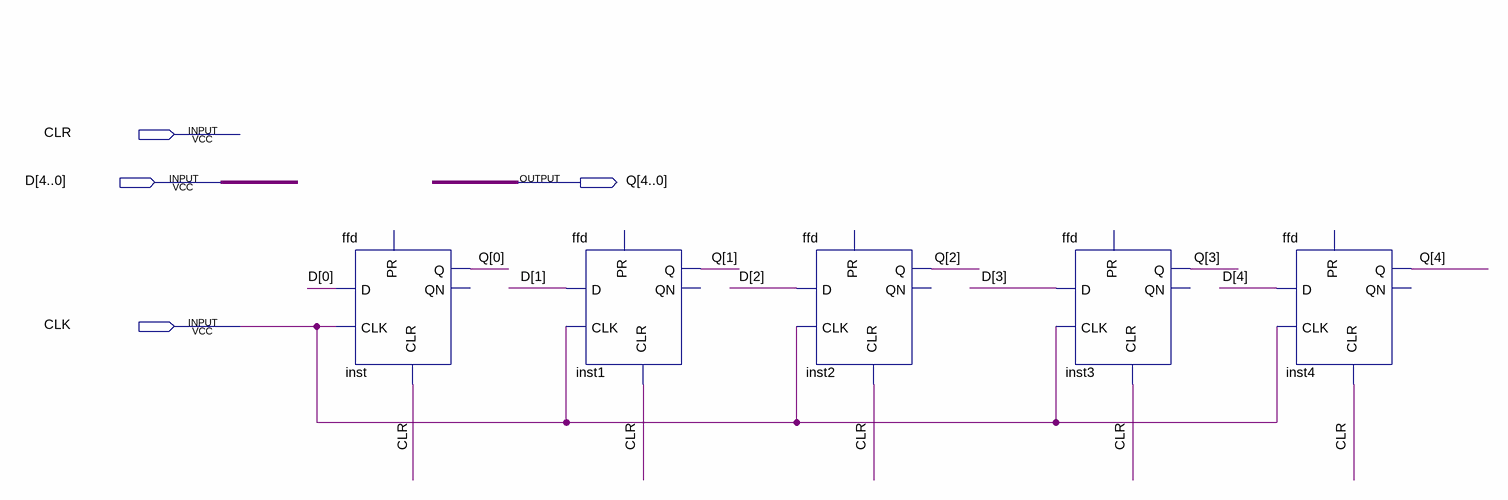
[diagram p0: schematic sheet]
// Quartus schematic Res5bits.bdf as structural Verilog: 5 symbols, 4 pins
module Res5bits (
  input  CLR,
  input  [4:0] D,
  input  CLK,
  output [4:0] Q
);

  ffd inst (.D(D[0]), .CLK(CLK), .CLR(CLR), .Q(Q[0]));  // open: PR, QN
  ffd inst1 (.D(D[1]), .CLK(CLK), .CLR(CLR), .Q(Q[1]));  // open: PR, QN
  ffd inst2 (.D(D[2]), .CLK(CLK), .CLR(CLR), .Q(Q[2]));  // open: PR, QN
  ffd inst3 (.D(D[3]), .CLK(CLK), .CLR(CLR), .Q(Q[3]));  // open: PR, QN
  ffd inst4 (.D(D[4]), .CLK(CLK), .CLR(CLR), .Q(Q[4]));  // open: PR, QN
endmodule
